# EAGLE design CANdiy-Shield_v20 (EAGLE 7.5.0)
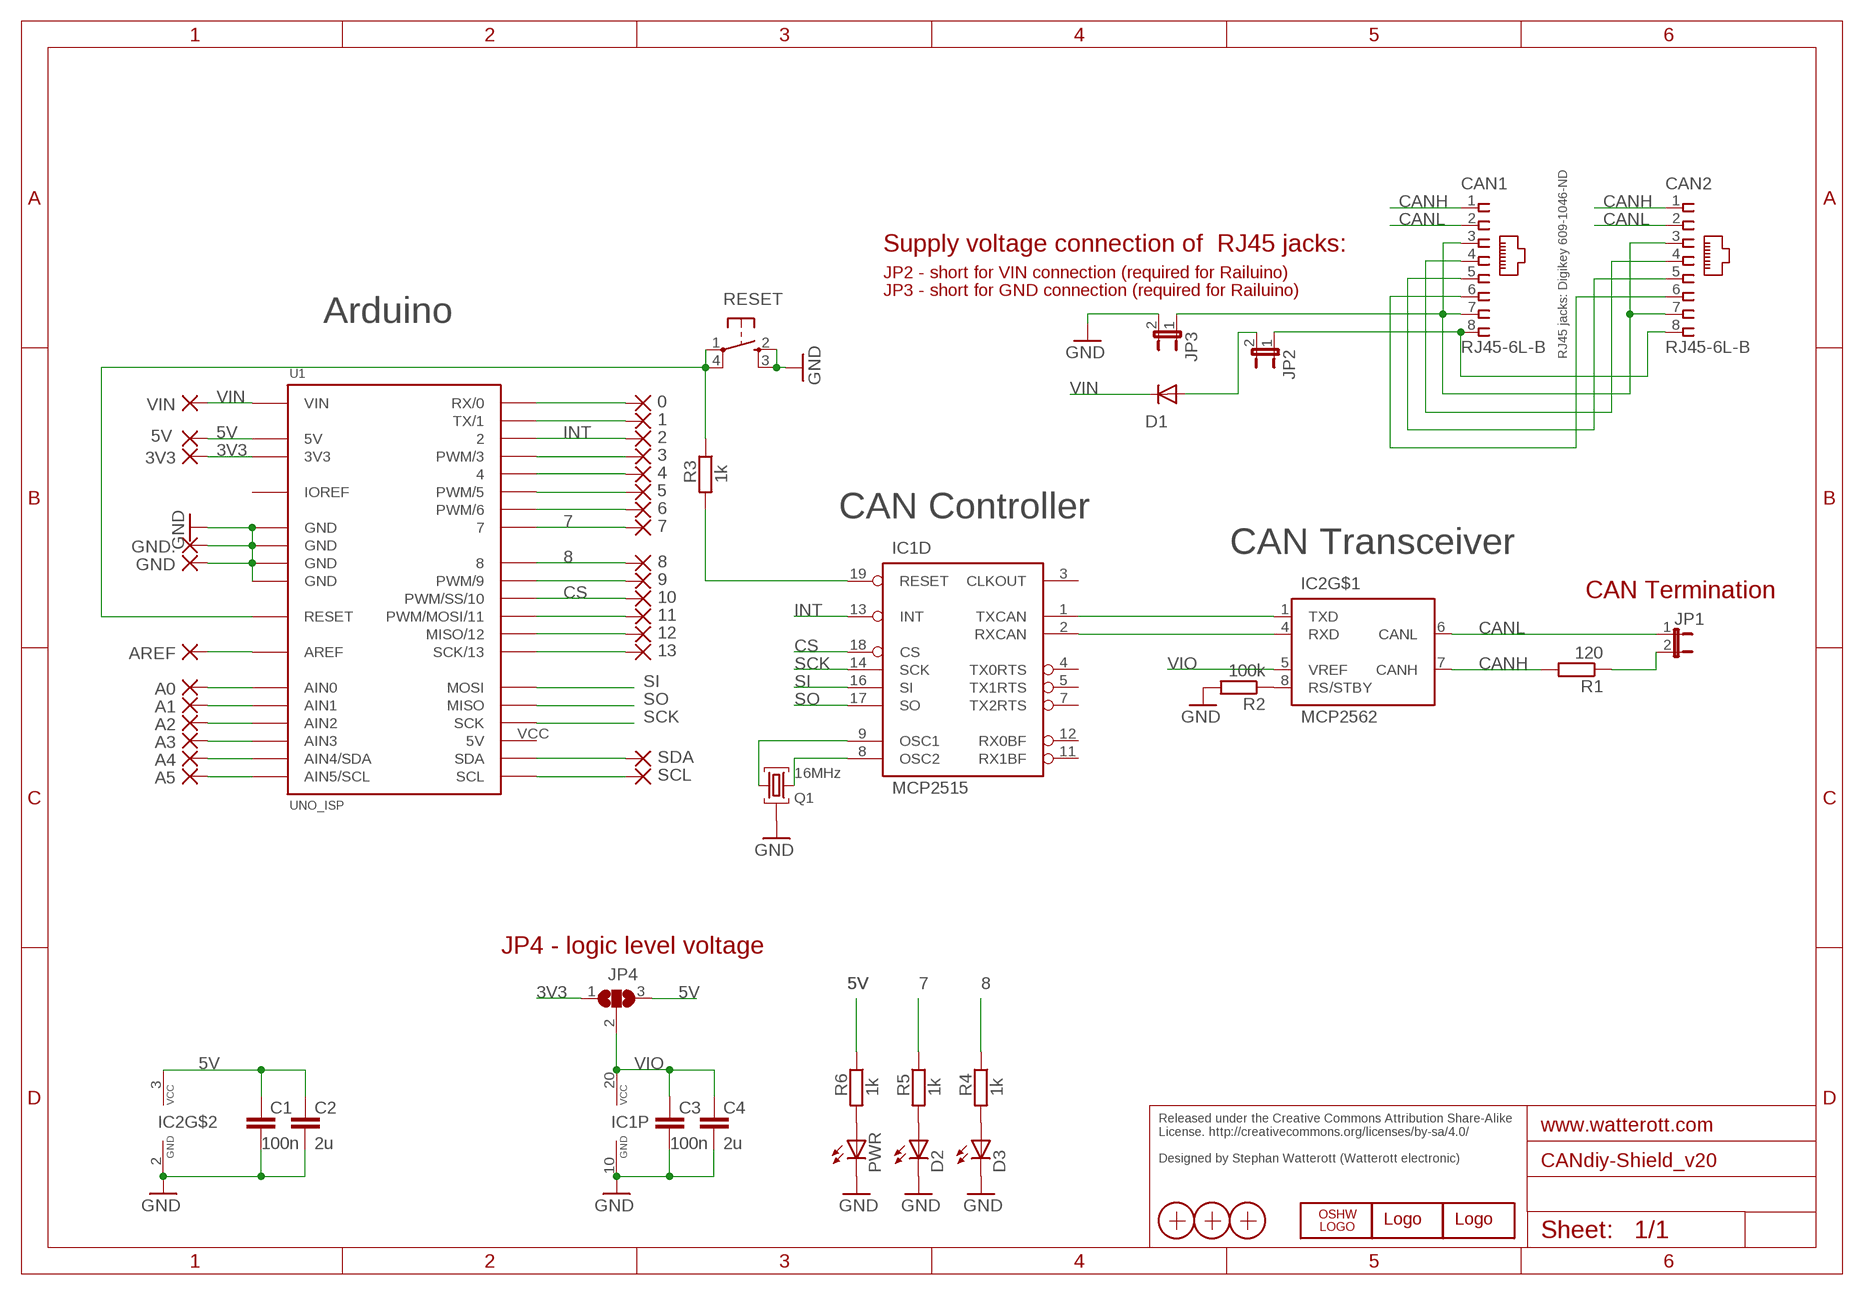
[diagram p0: schematic, sheet 1]

## Parts
0  1,6/0,8  [1,6/0,8]
1  1,6/0,8  [1,6/0,8]
2  1,6/0,8  [1,6/0,8]
3  1,6/0,8  [1,6/0,8]
3V3  1,6/0,8  [1,6/0,8]
4  1,6/0,8  [1,6/0,8]
5  1,6/0,8  [1,6/0,8]
5V  1,6/0,8  [1,6/0,8]
6  1,6/0,8  [1,6/0,8]
7  1,6/0,8  [1,6/0,8]
8  1,6/0,8  [1,6/0,8]
9  1,6/0,8  [1,6/0,8]
10  1,6/0,8  [1,6/0,8]
11  1,6/0,8  [1,6/0,8]
12  1,6/0,8  [1,6/0,8]
13  1,6/0,8  [1,6/0,8]
A0  1,6/0,8  [1,6/0,8]
A1  1,6/0,8  [1,6/0,8]
A2  1,6/0,8  [1,6/0,8]
A3  1,6/0,8  [1,6/0,8]
A4  1,6/0,8  [1,6/0,8]
A5  1,6/0,8  [1,6/0,8]
AREF  1,6/0,8  [1,6/0,8]
C1  100n  C-EUC0603  [C0603]
C2  2u  C-EUC0603  [C0603]
C3  100n  C-EUC0603  [C0603]
C4  2u  C-EUC0603  [C0603]
CAN1  RJ45-6L-B  [RJ45-NO-SHIELD]
CAN2  RJ45-6L-B  [RJ45-NO-SHIELD]
D1  CGRM4001-G  [SOD-123_MINI-SMA]
D2  LEDCHIPLED_0603  [CHIPLED_0603]
D3  LEDCHIPLED_0603  [CHIPLED_0603]
GND  1,6/0,8  [1,6/0,8]
GND.  1,6/0,8  [1,6/0,8]
IC1  MCP2515  MCP2515ST  [TSSOP20]
IC2  MCP2562  MCP2551SO8  [SO08]
JP1  JP1E  [JP1]
JP2  JP1E  [JP1]
JP3  JP1E  [JP1]
JP4  SJ2W  [SJ_2]
LOGO1  LOGO-SPARK_PLACE  [SPARK_TPLACE]
LOGO2  OSHW_LOGO_6MILX0100-NT  [OSHW_6X100_NOTEXT]
PWR  LEDCHIPLED_0603  [CHIPLED_0603]
Q1  16MHz  SMD_OSC2  [SMD_OSC_35X15]
R1  120  R-EU_R0603  [R0603]
R2  100k  R-EU_R0603  [R0603]
R3  1k  R-EU_R0603  [R0603]
R4  1k  R-EU_R0603  [R0603]
R5  1k  R-EU_R0603  [R0603]
R6  1k  R-EU_R0603  [R0603]
RESET  SW_SMDS  [SW_SMD4]
SCL  1,6/0,8  [1,6/0,8]
SDA  1,6/0,8  [1,6/0,8]
U1  UNO_ISP  [UNO_ISP]
U$1  WE-LOGO  [WE-LOGO]
VIN  1,6/0,8  [1,6/0,8]
X1  PASSER  [PASSER]
X2  PASSER  [PASSER]
X3  PASSER  [PASSER]

## Nets
0: 0.1(P) U1.0(RX/0)
1: 1.1(P) U1.1(TX/1)
3: 3.1(P) U1.3(PWM/3)
3V3: 3V3.1(P) JP4.1 U1.3V3
4: 4.1(P) U1.4
5: 5.1(P) U1.5(PWM/5)
5V: 5V.1(P) C1.1 C2.1 IC2.3(VCC) JP4.3 R6.1 U1.5V
6: 6.1(P) U1.6(PWM/6)
7: 7.1(P) R5.1 U1.7
8: 8.1(P) R4.1 U1.8
9: 9.1(P) U1.9(PWM/9)
11: 11.1(P) U1.11(PWM/MOSI/11)
12: 12.1(P) U1.12(MISO/12)
13: 13.1(P) U1.13(SCK/13)
A0: A0.1(P) U1.AIN0
A1: A1.1(P) U1.AIN1
A2: A2.1(P) U1.AIN2
A3: A3.1(P) U1.AIN3
A4: A4.1(P) U1.AIN4(AIN4/SDA)
A5: A5.1(P) U1.AIN5(AIN5/SCL)
AREF: AREF.1(P) U1.AREF
CAN_RX: IC1.2(D:RXCAN) IC2.4(RXD)
CAN_TX: IC1.1(D:TXCAN) IC2.1(TXD)
CANH: CAN1.1 CAN2.1 IC2.7(CANH) R1.2
CANL: CAN1.2 CAN2.2 IC2.6(CANL) JP1.1
CS: 10.1(P) IC1.18(D:CS) U1.10(PWM/SS/10)
GND: C1.2 C2.2 C3.2 C4.2 D2.C D3.C GND.1(P) GND..1(P) IC1.10(P:GND) IC2.2(GND) JP3.2 PWR.C Q1.GND R2.2 RESET.2(S) RESET.3(S1) U1.GND@1(GND) U1.GND@2(GND) U1.GND@3(GND) U1.GND@4(GND)
INT: 2.1(P) IC1.13(D:INT) U1.2
N$1: IC1.19(D:RESET) R3.2
N$6: CAN1.8 CAN2.8 JP2.1
N$7: IC2.8(RS) R2.1
N$8: CAN1.3 CAN1.7 CAN2.3 CAN2.7 JP3.1
N$9: JP1.2 R1.1
N$18: SCL.1(P) U1.SCL
N$19: SDA.1(P) U1.SDA
N$21: D3.A R4.2
N$22: PWR.A R6.2
N$23: D2.A R5.2
N$121: D1.A JP2.2
N$199: CAN1.4 CAN2.4
N$200: CAN1.5 CAN2.5
N$201: CAN1.6 CAN2.6
OSC1: IC1.9(D:OSC1) Q1.1
OSC2: IC1.8(D:OSC2) Q1.2
RESET: R3.1 RESET.1(P) RESET.4(P1) U1.RST(RESET)
SCK: IC1.14(D:SCK) U1.SCK
SI: IC1.16(D:SI) U1.MOSI
SO: IC1.17(D:SO) U1.MISO
VIN: D1.C U1.VIN VIN.1(P)
VIO: C3.1 C4.1 IC1.20(P:VCC) IC2.5(VREF) JP4.2
Unconnected: IC1.3(D:CLKOUT) IC1.4(D:TX0RTS) IC1.5(D:TX1RTS) IC1.7(D:TX2RTS) IC1.11(D:RX1BF) IC1.12(D:RX0BF) U1.VCC(5V)

## Notes on the sheet
- Supply voltage connection of  RJ45 jacks:
- JP2 - short for VIN connection (required for Railuino)
- JP3 - short for GND connection (required for Railuino)
- Arduino
- RJ45 jacks: Digikey 609-1046-ND
- CAN Controller
- CAN Transceiver
- CAN Termination
- /STBY
- JP4 - logic level voltage
- Released under the Creative Commons Attribution Share-Alike 
  License. http://creativecommons.org/licenses/by-sa/4.0/
  
  Designed by Stephan Watterott (Watterott electronic)

## Power pins joined to a net without a drawn wire
IOREF: U1.IOREF

## Library data of the parts
0 1-3 3V3 4 5 5V 6-13 A0 A1-A5 AREF GND GND. SCL SDA VIN = wirepad:1,6/0,8: THROUGH-HOLE PAD
C1-C4 = resistor:C-EU: CAPACITOR, European symbol
CAN1 CAN2 = con-tycoelectronics:RJ45: CORCOM Modular RJ Jacks No Shield Source: www.tycoelectronics.com .. ENG_DS_1654001_1099_RJ_L_0507.pdf; MPN: RJ45-6L-B; OC_FARNELL: unknown; OC_NEWARK: 16R6090
D1 = diode:CGRM400*-G: Molded plasitc,JEDEC SOD-123/Mini SMA Source: Comchip CGRM4001-G.pdf
D2 D3 PWR = led:LED: LED OSRAM: - CHIPLED LG R971, LG N971, LY N971, LG Q971, LY Q971, LO R971, LY R971 LH N974, LH R974 LS Q976, LO Q976, LY Q976 LO Q996 - Hyper CHIPLED LW Q18S LB Q993, LB Q99A, LB R99A - SideLED LS A670, LO A670, LY A670, LG A670, LP A670 LB A673, LV A673, LT A673, LW A673 LH A674 LY A675 LS A676, LA A676, LO A676, LY A676, LW A676 LS A679, LY A679, LG A679 - Hyper Micro SIDELED® LS Y876, LA Y876, LO Y876, LY Y876 LT Y87S - SmartLED LW L88C, LW L88S LB L89C, LB L89S, LG L890 LS L89K, LO L89K, LY L89K LS L896, LA L896, LO L896, LY L896 - TOPLED LS T670, LO T670, LY T670, LG T670, LP T670 LSG T670, LSP T670, LSY T670, LOP T670, LYG T670 LG T671, LOG T671, LSG T671 LB T673, LV T673, LT T673, LW T673 LH T674 LS T676, LA T676, LO T676, LY T676, LB T676, LH T676, LSB T676, LW T676 LB T67C, LV T67C, LT T67C, LS T67K, LO T67K, LY T67K, LW E67C LS E67B, LA E67B, LO E67B, LY E67B, LB E67C, LV E67C, LT E67C LW T67C LS T679, LY T679, LG T679 LS T770, LO T770, LY T770, LG T770, LP T770 LB T773, LV T773, LT T773, LW T773 LH T774 LS E675, LA E675, LY E675, LS T675 LS T776, LA T776, LO T776, LY T776, LB T776 LHGB T686 LT T68C, LB T68C - Hyper Mini TOPLED® LB M676 - Mini TOPLED Santana® LG M470 LS M47K, LO M47K, LY M47K Source: http://www.osram.convergy.de LUXEON: - LUMILED® LXK2-PW12-R00, LXK2-PW12-S00, LXK2-PW14-U00, LXK2-PW14-V00 LXK2-PM12-R00, LXK2-PM12-S00, LXK2-PM14-U00 LXK2-PE12-Q00, LXK2-PE12-R00, LXK2-PE12-S00, LXK2-PE14-T00, LXK2-PE14-U00 LXK2-PB12-K00, LXK2-PB12-L00, LXK2-PB12-M00, LXK2-PB14-N00, LXK2-PB14-P00, LXK2-PB14-Q00 LXK2-PR12-L00, LXK2-PR12-M00, LXK2-PR14-Q00, LXK2-PR14-R00 LXK2-PD12-Q00, LXK2-PD12-R00, LXK2-PD12-S00 LXK2-PH12-R00, LXK2-PH12-S00 LXK2-PL12-P00, LXK2-PL12-Q00, LXK2-PL12-R00 Source: www.luxeon.com KINGBRIGHT: KA-3528ASYC Source: www.kingbright.com
IC1 = can:MCP2515: MC2515 Stand-Alone CAN Controller With SPI Interface, Microchip
IC2 = can:MCP2551: CAN Tranceiver Microchip
JP1-JP3 = jumper:JP1E: JUMPER
JP4 = jumper:SJ2W: SMD solder JUMPER
LOGO1 = we-symbol:LOGO
LOGO2 = OSHW:OSHW_LOGO_6MIL
Q1 = crystal:SMD_OSC
R1 R2 = resistor:R-EU_: RESISTOR, European symbol
R3-R6 = rcl:R-EU_: RESISTOR, European symbol
RESET = Switch-SMD:SW_SMD
U1 = Arduino:UNO_ISP
U$1 = welectronic:WE-LOGO
X1-X3 = we-symbol:PASSER

## Board
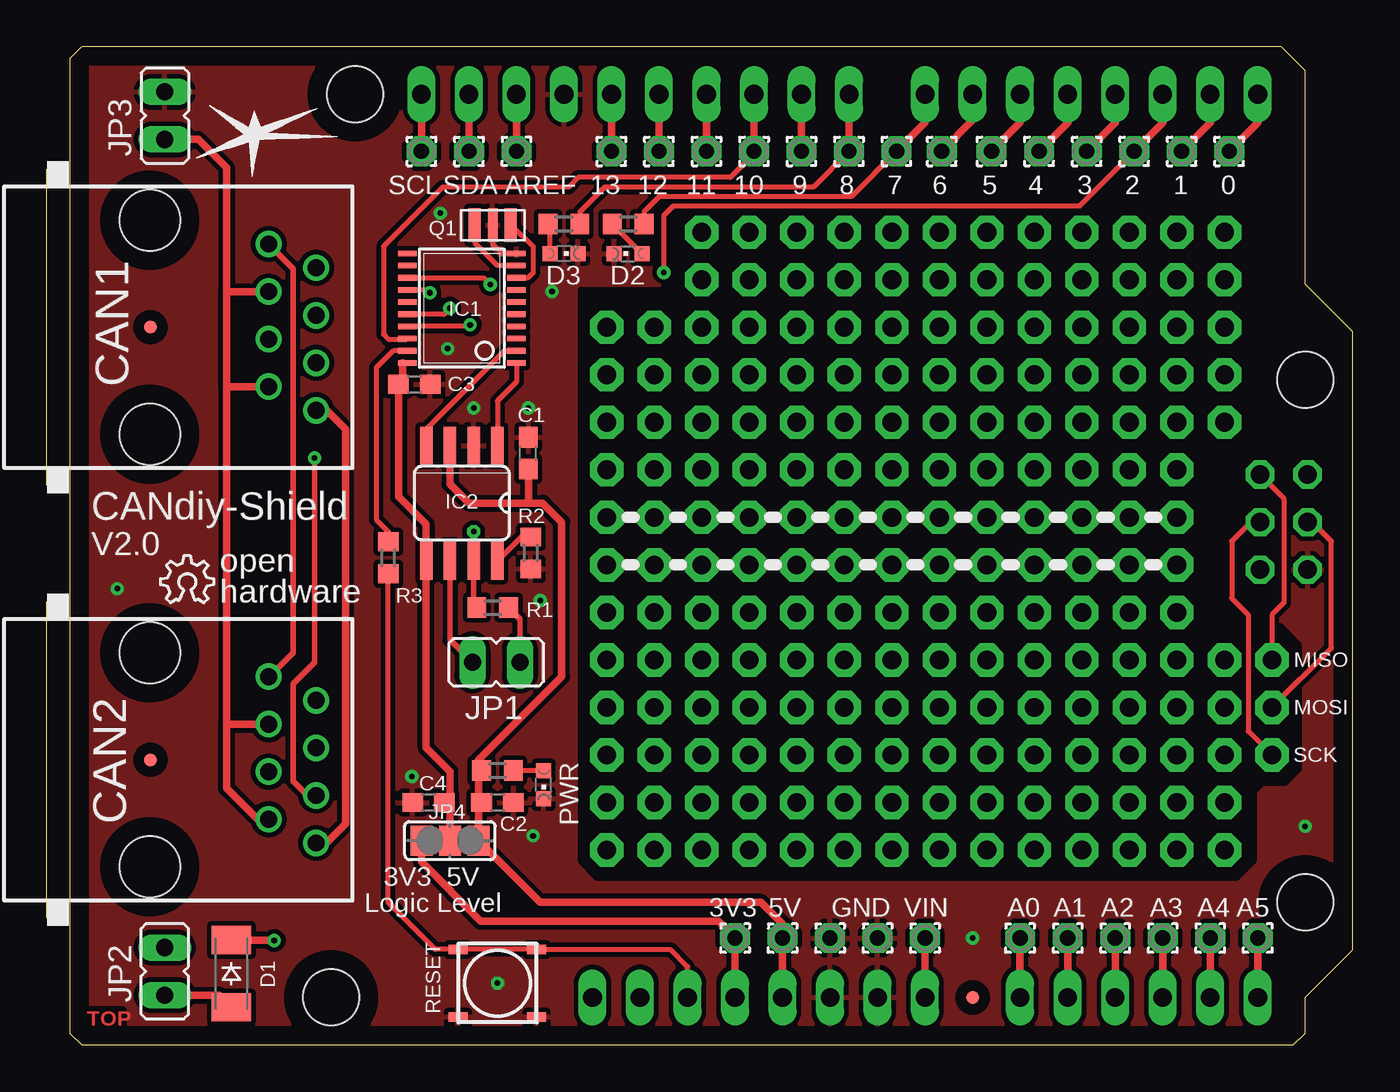
[diagram p1: board, top side]
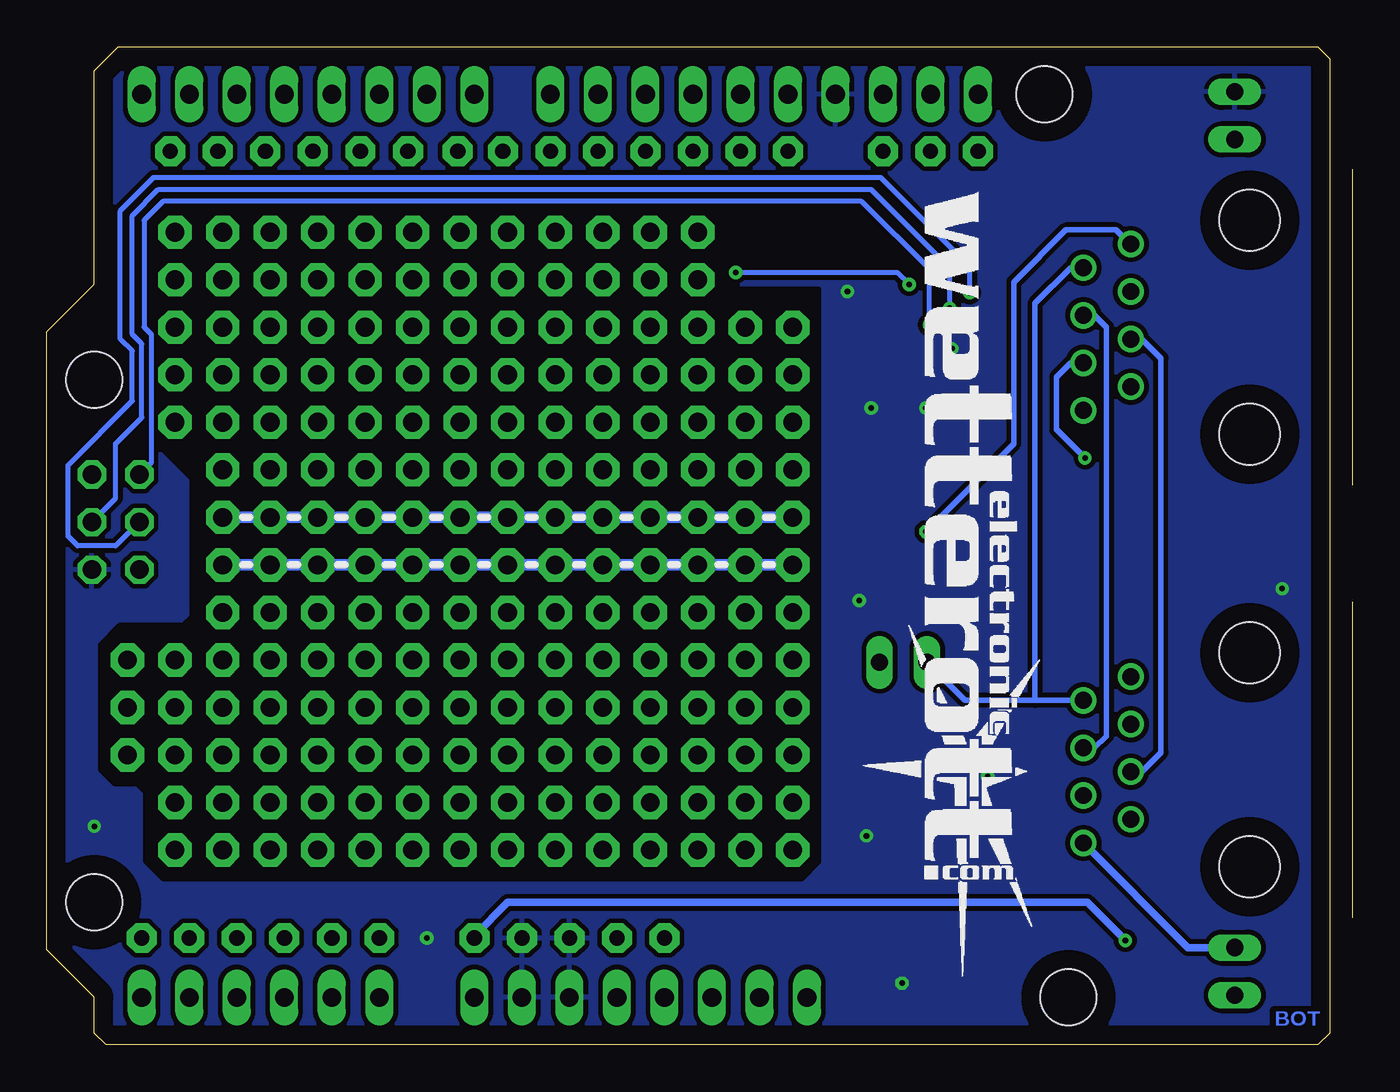
[diagram p2: board, bottom side, seen from below]

Size 69.81 x 53.34 mm. Coordinates in mm from the lower left corner, seen from the top.
Copper layers (1*16): Top 0.035mm / dielectric 1.5mm / Bottom 0.035mm
Design rules "default *": minimum track width 6mil, minimum drill 0.29mm, track to track 6mil, track to pad 6mil, pad to pad 6mil, via to via 6mil, smd to smd 6mil, copper to edge 40mil, drill to drill 6mil, minimum pad ring 10mil, minimum via ring 8mil, stop-mask expansion 4mil, vias tented up to drill 0.6mm, thermal gap 10mil

### Footprints (pad centres in the part's own frame; a part is rotated, then mirrored left to right if it is on the bottom)
1,6/0,8 = drill 0.813 pad 1.6 octagon: 1 0,0
C0603 = smd 1.1 x 1: 1 -0.85,0; 2 0.85,0
RJ45-NO-SHIELD = drill 0.9 pad 1.4: 1 -4.445,6.35; 2 -3.175,8.89; 3 -1.905,6.35; 4 -0.635,8.89; 5 0.635,6.35; 6 1.905,8.89; 7 3.175,6.35; 8 4.445,8.89 | hole 3.251: -5.715,0; 5.715,0
SOD-123_MINI-SMA = smd 1.5 x 2.1: A 1.8,0; C -1.8,0
CHIPLED_0603 = smd 0.8 x 0.8: A 0,-0.75; C 0,0.75
TSSOP20 = smd 0.305 x 0.991: 1 -2.925,-2.918; 2 -2.275,-2.918; 3 -1.625,-2.918; 4 -0.975,-2.918; 5 -0.325,-2.918; 6 0.325,-2.918; 7 0.975,-2.918; 8 1.625,-2.918; 9 2.275,-2.918; 10 2.925,-2.918; 11 2.925,2.918; 12 2.275,2.918; 13 1.625,2.918; 14 0.975,2.918; 15 0.325,2.918; 16 -0.325,2.918; 17 -0.975,2.918; 18 -1.625,2.918; 19 -2.275,2.918; 20 -2.925,2.918
SO08 = smd 0.66 x 2.032: 1 -1.905,-3.073; 2 -0.635,-3.073; 3 0.635,-3.073; 4 1.905,-3.073; 5 1.905,3.073; 6 0.635,3.073; 7 -0.635,3.073; 8 -1.905,3.073
JP1 = drill 0.914 long: 1 0,-1.27; 2 0,1.27
SJ_2 = smd 1.168 x 1.6: 1 -1.524,0; 2 0,0; 3 1.524,0
SMD_OSC_35X15 = smd 0.635 x 1.778: 1 -0.965,0; 2 0.965,0 | smd 0.508 x 1.778: GND 0,0
R0603 = smd 1 x 1.1: 1 -0.85,0; 2 0.85,0
SW_SMD4 = smd 0.508 x 1.016: 1 -1.8,-2.1; 2 1.8,-2.1; 3 1.8,2.1; 4 -1.8,2.1
UNO_ISP = drill 1 long: 0 63.5,50.8; 1 60.96,50.8; 2 58.42,50.8; 3 55.88,50.8; 3V3 35.56,2.54; 4 53.34,50.8; 5 50.8,50.8; 5V 38.1,2.54; 6 48.26,50.8; 7 45.72,50.8; 8 41.656,50.8; 9 39.116,50.8; 10 36.576,50.8; 11 34.036,50.8; 12 31.496,50.8; 13 28.956,50.8; AIN0 50.8,2.54; AIN1 53.34,2.54; AIN2 55.88,2.54; AIN3 58.42,2.54; AIN4 60.96,2.54; AIN5 63.5,2.54; AREF 23.876,50.8; GND@1 40.64,2.54; GND@2 43.18,2.54; GND@3 26.416,50.8; IOREF 30.48,2.54; NC 27.94,2.54; RST 33.02,2.54; SCL 18.796,50.8; SDA 21.336,50.8; VIN 45.72,2.54 | drill 1 octagon: GND@4 66.167,25.4; MISO 63.627,30.48; MOSI 66.167,27.94; RST2 63.627,25.4; SCK 63.627,27.94; VCC 66.167,30.48 | hole 3: 66.04,35.56; 66.04,7.62; 15.24,50.8; 13.97,2.54
PASSER = smd 0.7 x 0.7: X 0,0

### Placement (x,y rotation side)
0  63.21,47.75 180 top
1  60.67,47.75 180 top
2  58.13,47.75 180 top
3  55.59,47.75 180 top
3V3  36.79,5.71 0 top
4  53.05,47.75 180 top
5  50.51,47.75 180 top
5V  39.33,5.71 0 top
6  47.84,47.75 180 top
7  45.43,47.75 180 top
8  42.89,47.75 180 top
9  40.35,47.75 180 top
10  37.81,47.75 180 top
11  35.27,47.75 180 top
12  32.73,47.75 180 top
13  30.19,47.75 180 top
A0  52.03,5.71 0 top
A1  54.57,5.71 0 top
A2  57.11,5.71 0 top
A3  59.65,5.71 0 top
A4  62.19,5.71 0 top
A5  64.73,5.71 0 top
AREF  25.11,47.75 0 top
C1  25.74,31.62 90 top
C2  24.09,12.95 0 top
C3  19.65,35.31 0 top
C4  20.41,12.95 180 top
CAN1  5.51,38.35 270 top
CAN2  5.51,15.24 270 top
D1  9.87,3.81 270 top
D2  31.08,42.29 90 top
D3  27.65,42.29 270 top
GND  41.87,5.71 0 top
GND.  44.41,5.71 0 top
IC1  22.19,39.37 90 top
IC2  22.19,28.96 180 top
JP1  24.03,20.45 270 top
JP2  6.31,3.94 180 top
JP3  6.31,49.66 0 top
JP4  21.55,10.92 0 top
LOGO1  11.14,48.64 0 top
LOGO2  6.09,23.62 0 top
PWR  26.57,13.91 180 top
Q1  23.84,43.82 0 top
R1  23.84,23.37 180 top
R2  25.87,26.29 270 top
R3  18.25,26.04 90 top
R4  27.65,43.88 180 top
R5  31.08,43.88 180 top
R6  24.09,14.67 0 top
RESET  24.09,3.3 270 top
SCL  20.03,47.75 180 top
SDA  22.57,47.75 180 top
U1  1.23,0 0 top
U$1  26.5,45.85 270 bottom
VIN  46.95,5.71 0 top
X1  5.55,15.24 0 top
X2  5.55,38.35 0 top
X3  49.49,2.54 0 top

### Tracks (layer width: path | path; a pad name or v marks a point on that pad's centre or on a via)
0
  Top 0.406: U1.0 64.73,49.28 0.1
1
  Top 0.406: U1.1 62.19,49.28 1.1
3
  Top 0.406: U1.3 57.11,49.28 3.1
3V3
  Top 0.406: U1.3V3 3V3.1 35.9,6.6 23.2,6.6 20.03,9.78 JP4.1
4
  Top 0.406: U1.4 54.57,49.28 4.1
5
  Top 0.406: U1.5 52.03,49.28 5.1
5V
  Top 0.254: 23.08,12.79 C2.1 23.08,12.95 | 23.08,14.5 R6.1 23.14,14.67 23.08,14.73
  Top 0.406: U1.5V 5V.1 39.33,6.48 38.19,7.62 26.38,7.62 JP4.3 23.08,12.79 | IC2.3 21.55,29.97 22.57,28.96 25.74,28.96 | 25.74,28.96 26.5,28.96 27.52,27.94 27.52,19.68 23.08,15.24 23.08,14.73 | C1.1 25.74,28.96 | 23.08,12.95 23.08,14.5
6
  Top 0.406: U1.6 49.49,49.4 6.1
7
  Top 0.254: 7.1 43.01,45.34 32.73,45.34 31.93,44.54 R5.1
  Top 0.406: U1.7 46.95,49.28 7.1
8
  Top 0.254: 8.1 40.98,45.85 29.81,45.85 28.5,44.54 R4.1
  Top 0.406: U1.8 8.1
9
  Top 0.406: U1.9 9.1
11
  Top 0.406: 11.1 U1.11
12
  Top 0.406: 12.1 U1.12
13
  Top 0.406: 13.1 U1.13
A0
  Top 0.406: U1.AIN0 A0.1
A1
  Top 0.406: U1.AIN1 A1.1
A2
  Top 0.406: U1.AIN2 A2.1
A3
  Top 0.406: U1.AIN3 A3.1
A4
  Top 0.406: U1.AIN4 A4.1
A5
  Top 0.406: U1.AIN5 A5.1
AREF
  Top 0.406: AREF.1 U1.AREF
CAN_RX
  Top 0.254: IC2.4 20.28,32.89 24.47,37.08 25.09,37.08 IC1.2
CAN_TX
  Top 0.254: IC1.1 25.1,35.43 24.09,34.42 IC2.1
CANH  (via drill 0.3)
  Top 0.254: CAN2.1 11.9,19.68
  Top 0.305: R1.2 22.82,23.53 IC2.7 v22.82,27.43 | 11.9,19.68 13.17,20.95 13.17,41.49 CAN1.1
  Bottom 0.254: CAN1.1 11.9,42.8
  Bottom 0.305: 11.9,42.8 12.66,43.56 15.33,43.56 18.12,40.77 18.12,32.13 v22.82,27.43
CANL
  Top 0.305: IC2.6 21.55,21.65 JP1.1
  Bottom 0.305: CAN2.2 16.98,18.41 | 16.98,18.41 20.73,18.41 JP1.1 | CAN1.2 15.07,41.53 16.98,39.62 16.98,18.41
CS
  Top 0.254: 10.1 37.81,47.62 36.54,46.36 28.41,46.36 27.9,45.85 21.17,45.85 18,42.67 18,37.97 18.25,37.72 19.24,37.72 IC1.18
  Top 0.406: U1.10 10.1
GND  (via drill 0.3)
  Top 0.254: IC1.10 24.34,42.3 23.84,42.8 Q1.GND
  other vias: 22.82,34.04 21.42,37.21 27.01,40.26 24.09,3.3 21.04,44.45 26.38,23.75 25.74,34.04 67.27,11.68 19.52,14.35 26,11.18 3.77,24.38 49.49,5.71
  pour Bottom (isolate 0.254): 1.23,53.47 69.81,53.47 69.81,0.13 1.23,0.13
  pour Top (isolate 0.254): 1.23,0.13 1.23,53.47 69.81,53.47 69.81,0.13
INT  (via drill 0.3)
  Top 0.254: 2.1 55.21,44.83 33.49,44.83 32.98,44.32 v32.98,41.28 | IC1.13 23.36,41 v23.71,40.64
  Top 0.406: U1.2 59.65,49.28 2.1
  Bottom 0.254: v23.71,40.64 24.35,41.28 v32.98,41.28
N$1
  Top 0.254: IC1.19 18.51,37.1 17.61,36.2 17.61,28.07 18.25,27.43 R3.2
N$2  (via drill 1 pad 1.78)
  other vias: 32.47,15.49
N$3  (via drill 1 pad 1.78)
  other vias: 29.93,15.49
N$4  (via drill 1 pad 1.78)
  other vias: 32.47,12.95
N$5  (via drill 1 pad 1.78)
  other vias: 29.93,12.95
N$6
  Top 0.406: CAN2.8 14.95,10.79 15.96,11.81 15.96,32.89 14.95,33.91 CAN1.8
  Bottom 0.406: JP2.1 8.81,5.21 CAN2.8
N$7
  Top 0.254: R2.1 25.35,27.14 IC2.8
N$8
  Top 0.406: JP3.1 8.09,48.39 9.61,46.86 9.61,40.26 | 9.61,40.26 CAN1.3 | 9.61,35.18 9.61,40.26 | CAN1.7 9.61,35.18 | 9.61,35.18 9.61,17.14 | 9.61,17.14 CAN2.3 | CAN2.7 11.26,12.07 9.61,13.72 9.61,17.14
N$9
  Top 0.305: JP1.2 25.3,22.76 R1.1
N$10  (via drill 1 pad 1.78)
  other vias: 60.41,35.81
N$11  (via drill 1 pad 1.78)
  other vias: 57.87,35.81
N$12  (via drill 1 pad 1.78)
  other vias: 55.33,35.81
N$14  (via drill 1 pad 1.78)
  other vias: 52.79,35.81
N$15  (via drill 1 pad 1.78)
  other vias: 50.25,35.81
N$16  (via drill 1 pad 1.78)
  other vias: 47.71,35.81
N$17  (via drill 1 pad 1.78)
  other vias: 45.17,35.81
N$18
  Top 0.406: SCL.1 U1.SCL
N$19
  Top 0.406: SDA.1 U1.SDA
N$20  (via drill 1 pad 1.78)
  other vias: 42.63,38.35
N$21
  Top 0.254: D3.A 26.9,43.78 R4.2
N$22
  Top 0.254: R6.2 26.56,14.67 PWR.A
N$23
  Top 0.254: D2.A R5.2
N$24  (via drill 1 pad 1.78)
  other vias: 42.63,10.41
N$25  (via drill 1 pad 1.78)
  other vias: 42.63,35.81
N$26  (via drill 1 pad 1.78)
  other vias: 62.95,38.35
N$27  (via drill 1 pad 1.78)
  other vias: 60.41,38.35
N$28  (via drill 1 pad 1.78)
  other vias: 57.87,38.35
N$29  (via drill 1 pad 1.78)
  other vias: 55.33,38.35
N$30  (via drill 1 pad 1.78)
  other vias: 52.79,38.35
N$31  (via drill 1 pad 1.78)
  other vias: 50.25,38.35
N$32  (via drill 1 pad 1.78)
  other vias: 47.71,38.35
N$33  (via drill 1 pad 1.78)
  other vias: 45.17,38.35
N$34  (via drill 1 pad 1.78)
  other vias: 42.63,33.27
N$35  (via drill 1 pad 1.78)
  other vias: 42.63,30.73
N$36  (via drill 1 pad 1.78)
  other vias: 42.63,28.19
N$37  (via drill 1 pad 1.78)
  other vias: 62.95,40.89
N$38  (via drill 1 pad 1.78)
  other vias: 60.41,40.89
N$39  (via drill 1 pad 1.78)
  other vias: 57.87,40.89
N$40  (via drill 1 pad 1.78)
  other vias: 55.33,40.89
N$41  (via drill 1 pad 1.78)
  other vias: 62.95,20.57
N$42  (via drill 1 pad 1.78)
  other vias: 62.95,10.41
N$43  (via drill 1 pad 1.78)
  other vias: 60.41,10.41
N$44  (via drill 1 pad 1.78)
  other vias: 57.87,10.41
N$45  (via drill 1 pad 1.78)
  other vias: 55.33,10.41
N$46  (via drill 1 pad 1.78)
  other vias: 52.79,10.41
N$47  (via drill 1 pad 1.78)
  other vias: 50.25,10.41
N$48  (via drill 1 pad 1.78)
  other vias: 47.71,10.41
N$49  (via drill 1 pad 1.78)
  other vias: 45.17,10.41
N$50  (via drill 1 pad 1.78)
  other vias: 52.79,40.89
N$51  (via drill 1 pad 1.78)
  other vias: 50.25,40.89
N$52  (via drill 1 pad 1.78)
  other vias: 47.71,40.89
N$53  (via drill 1 pad 1.78)
  other vias: 45.17,40.89
N$54  (via drill 1 pad 1.78)
  other vias: 42.63,25.65
N$55  (via drill 1 pad 1.78)
  other vias: 62.95,43.43
N$56  (via drill 1 pad 1.78)
  other vias: 60.41,43.43
N$57  (via drill 1 pad 1.78)
  other vias: 57.87,43.43
N$58  (via drill 1 pad 1.78)
  other vias: 55.33,43.43
N$59  (via drill 1 pad 1.78)
  other vias: 60.41,33.27
N$60  (via drill 1 pad 1.78)
  other vias: 57.87,33.27
N$61  (via drill 1 pad 1.78)
  other vias: 55.33,33.27
N$62  (via drill 1 pad 1.78)
  other vias: 52.79,33.27
N$63  (via drill 1 pad 1.78)
  other vias: 50.25,33.27
N$64  (via drill 1 pad 1.78)
  other vias: 47.71,33.27
N$65  (via drill 1 pad 1.78)
  other vias: 45.17,33.27
N$66  (via drill 1 pad 1.78)
  other vias: 52.79,43.43
N$67  (via drill 1 pad 1.78)
  other vias: 50.25,43.43
N$68  (via drill 1 pad 1.78)
  other vias: 47.71,43.43
N$69  (via drill 1 pad 1.78)
  other vias: 45.17,43.43
N$70  (via drill 1 pad 1.78)
  other vias: 42.63,23.11
N$71  (via drill 1 pad 1.78)
  other vias: 40.09,10.41
N$72  (via drill 1 pad 1.78)
  other vias: 62.95,18.03
N$73  (via drill 1 pad 1.78)
  other vias: 62.95,15.49
N$74  (via drill 1 pad 1.78)
  other vias: 62.95,12.95
N$75  (via drill 1 pad 1.78)
  other vias: 60.41,30.73
N$76  (via drill 1 pad 1.78)
  other vias: 57.87,30.73
N$77  (via drill 1 pad 1.78)
  other vias: 55.33,30.73
N$78  (via drill 1 pad 1.78)
  other vias: 52.79,30.73
N$79  (via drill 1 pad 1.78)
  other vias: 50.25,30.73
N$80  (via drill 1 pad 1.78)
  other vias: 47.71,30.73
N$81  (via drill 1 pad 1.78)
  other vias: 45.17,30.73
N$82  (via drill 1 pad 1.78)
  other vias: 42.63,20.57
N$83  (via drill 1 pad 1.78)
  other vias: 42.63,18.03
N$84  (via drill 1 pad 1.78)
  other vias: 42.63,15.49
N$85  (via drill 1 pad 1.78)
  other vias: 42.63,12.95
N$86  (via drill 1 pad 1.78)
  other vias: 32.47,10.41
N$87  (via drill 1 pad 1.78)
  other vias: 29.93,10.41
N$89  (via drill 1 pad 1.78)
  other vias: 37.55,10.41
N$90  (via drill 1 pad 1.78)
  other vias: 42.63,40.89
N$91
  cutout Top: 33.62,43.88 34.44,44.83 63.84,44.83 64.41,44.26 64.41,32.64 62.06,30.29 62.06,22.86 62.51,22.42 65.94,22.42 66.95,21.4 66.95,14.73 66.19,13.97 64.99,13.97 64.54,13.53 64.54,9.84 63.59,8.89 29.43,8.89 28.54,9.78 28.54,40.39 33.36,40.39 33.62,40.64 33.62,44.07
N$92  (via drill 1 pad 1.78)
  other vias: 57.87,28.19
N$93  (via drill 1 pad 1.78)
  other vias: 55.33,28.19
N$94  (via drill 1 pad 1.78)
  other vias: 52.79,28.19
N$95  (via drill 1 pad 1.78)
  other vias: 50.25,28.19
N$96  (via drill 1 pad 1.78)
  other vias: 47.71,28.19
N$97  (via drill 1 pad 1.78)
  other vias: 45.17,28.19
N$104  (via drill 1 pad 1.78)
  other vias: 42.63,43.43
N$108  (via drill 1 pad 1.78)
  other vias: 57.87,25.65
N$110  (via drill 1 pad 1.78)
  other vias: 52.79,25.65
N$111  (via drill 1 pad 1.78)
  other vias: 50.25,25.65
N$112  (via drill 1 pad 1.78)
  other vias: 47.71,25.65
N$113  (via drill 1 pad 1.78)
  other vias: 45.17,25.65
N$119  (via drill 1 pad 1.78)
  other vias: 62.95,35.81
N$121
  Top 0.406: JP2.2 9.21,2.67 D1.A
N$122
  cutout Bottom: 33.62,44.01 34.44,44.83 63.84,44.83 64.41,44.26 64.41,32.64 62.06,30.29 62.06,22.86 62.51,22.42 65.94,22.42 66.95,21.4 66.95,14.73 66.19,13.97 64.99,13.97 64.54,13.53 64.54,9.84 63.59,8.89 29.43,8.89 28.54,9.78 28.54,40.39 33.36,40.39 33.62,40.64
N$123  (via drill 1 pad 1.78)
  other vias: 60.41,23.11
N$124  (via drill 1 pad 1.78)
  other vias: 57.87,23.11
N$125  (via drill 1 pad 1.78)
  other vias: 55.33,23.11
N$126  (via drill 1 pad 1.78)
  other vias: 52.79,23.11
N$127  (via drill 1 pad 1.78)
  other vias: 50.25,23.11
N$128  (via drill 1 pad 1.78)
  other vias: 47.71,23.11
N$129  (via drill 1 pad 1.78)
  other vias: 45.17,23.11
N$130  (via drill 1 pad 1.78)
  other vias: 40.09,38.35
N$131  (via drill 1 pad 1.78)
  other vias: 37.55,38.35
N$132  (via drill 1 pad 1.78)
  other vias: 40.09,35.81
N$133  (via drill 1 pad 1.78)
  other vias: 37.55,35.81
N$134  (via drill 1 pad 1.78)
  other vias: 40.09,33.27
N$135  (via drill 1 pad 1.78)
  other vias: 37.55,33.27
N$136  (via drill 1 pad 1.78)
  other vias: 40.09,30.73
N$137  (via drill 1 pad 1.78)
  other vias: 37.55,30.73
N$138  (via drill 1 pad 1.78)
  other vias: 40.09,28.19
N$139  (via drill 1 pad 1.78)
  other vias: 60.41,20.57
N$140  (via drill 1 pad 1.78)
  other vias: 57.87,20.57
N$141  (via drill 1 pad 1.78)
  other vias: 55.33,20.57
N$142  (via drill 1 pad 1.78)
  other vias: 52.79,20.57
N$143  (via drill 1 pad 1.78)
  other vias: 50.25,20.57
N$144  (via drill 1 pad 1.78)
  other vias: 47.71,20.57
N$145  (via drill 1 pad 1.78)
  other vias: 45.17,20.57
N$146  (via drill 1 pad 1.78)
  other vias: 37.55,28.19
N$147  (via drill 1 pad 1.78)
  other vias: 40.09,40.89
N$148  (via drill 1 pad 1.78)
  other vias: 37.55,40.89
N$149  (via drill 1 pad 1.78)
  other vias: 40.09,43.43
N$150  (via drill 1 pad 1.78)
  other vias: 37.55,43.43
N$151  (via drill 1 pad 1.78)
  other vias: 35.01,38.35
N$152  (via drill 1 pad 1.78)
  other vias: 35.01,35.81
N$153  (via drill 1 pad 1.78)
  other vias: 35.01,33.27
N$154  (via drill 1 pad 1.78)
  other vias: 35.01,30.73
N$155  (via drill 1 pad 1.78)
  other vias: 60.41,18.03
N$156  (via drill 1 pad 1.78)
  other vias: 57.87,18.03
N$157  (via drill 1 pad 1.78)
  other vias: 55.33,18.03
N$158  (via drill 1 pad 1.78)
  other vias: 52.79,18.03
N$159  (via drill 1 pad 1.78)
  other vias: 50.25,18.03
N$160  (via drill 1 pad 1.78)
  other vias: 47.71,18.03
N$161  (via drill 1 pad 1.78)
  other vias: 45.17,18.03
N$162  (via drill 1 pad 1.78)
  Top 0.61: v35.01,28.19 v60.41,28.19
  Bottom 0.61: v35.01,28.19 v60.41,28.19
N$163  (via drill 1 pad 1.78)
  other vias: 35.01,40.89
N$164  (via drill 1 pad 1.78)
  other vias: 35.01,43.43
N$165  (via drill 1 pad 1.78)
  other vias: 40.09,25.65
N$166  (via drill 1 pad 1.78)
  other vias: 37.55,25.65
N$167  (via drill 1 pad 1.78)
  other vias: 40.09,23.11
N$168  (via drill 1 pad 1.78)
  other vias: 37.55,23.11
N$169  (via drill 1 pad 1.78)
  other vias: 40.09,20.57
N$171  (via drill 1 pad 1.78)
  other vias: 60.41,15.49
N$172  (via drill 1 pad 1.78)
  other vias: 57.87,15.49
N$173  (via drill 1 pad 1.78)
  other vias: 55.33,15.49
N$174  (via drill 1 pad 1.78)
  other vias: 52.79,15.49
N$175  (via drill 1 pad 1.78)
  other vias: 50.25,15.49
N$176  (via drill 1 pad 1.78)
  other vias: 47.71,15.49
N$177  (via drill 1 pad 1.78)
  other vias: 45.17,15.49
N$178  (via drill 1 pad 1.78)
  other vias: 37.55,20.57
N$179  (via drill 1 pad 1.78)
  other vias: 40.09,18.03
N$180  (via drill 1 pad 1.78)
  other vias: 37.55,18.03
N$181  (via drill 1 pad 1.78)
  other vias: 40.09,15.49
N$182  (via drill 1 pad 1.78)
  other vias: 37.55,15.49
N$183  (via drill 1 pad 1.78)
  other vias: 40.09,12.95
N$184  (via drill 1 pad 1.78)
  other vias: 37.55,12.95
N$185  (via drill 1 pad 1.78)
  other vias: 35.01,10.41
N$186  (via drill 1 pad 1.78)
  other vias: 35.01,25.65
N$187  (via drill 1 pad 1.78)
  other vias: 60.41,12.95
N$188  (via drill 1 pad 1.78)
  other vias: 57.87,12.95
N$189  (via drill 1 pad 1.78)
  other vias: 55.33,12.95
N$190  (via drill 1 pad 1.78)
  other vias: 52.79,12.95
N$191  (via drill 1 pad 1.78)
  other vias: 50.25,12.95
N$192  (via drill 1 pad 1.78)
  other vias: 47.71,12.95
N$193  (via drill 1 pad 1.78)
  other vias: 45.17,12.95
N$194  (via drill 1 pad 1.78)
  other vias: 35.01,23.11
N$195  (via drill 1 pad 1.78)
  other vias: 35.01,20.57
N$196  (via drill 1 pad 1.78)
  other vias: 35.01,18.03
N$197  (via drill 1 pad 1.78)
  other vias: 35.01,15.49
N$198  (via drill 1 pad 1.78)
  other vias: 35.01,12.95
N$199
  Bottom 0.305: CAN1.4 13.8,38.99 13.17,38.35 13.17,16.51 13.8,15.88 CAN2.4
N$200
  Bottom 0.305: CAN2.5 11.26,14.61 10.25,15.62 10.25,36.7 11.26,37.72 CAN1.5
N$201  (via drill 0.3)
  Top 0.305: CAN2.6 13.93,13.34 13.17,14.1 13.17,19.3 14.31,20.45 v14.31,31.37
  Bottom 0.305: CAN1.6 15.07,36.45 15.84,35.69 15.84,32.89 v14.31,31.37
N$202  (via drill 1 pad 1.78)
  Top 0.61: 30.06,25.65 v55.33,25.65 v60.41,25.65
  Bottom 0.61: v55.33,25.65 29.93,25.65 | v60.41,25.65 v55.33,25.65 | v55.33,25.65 35.14,25.65
N$203  (via drill 1 pad 1.78)
  other vias: 32.47,38.35
N$204  (via drill 1 pad 1.78)
  other vias: 32.47,35.81
N$205  (via drill 1 pad 1.78)
  other vias: 32.47,33.27
N$206  (via drill 1 pad 1.78)
  other vias: 32.47,30.73
N$207  (via drill 1 pad 1.78)
  other vias: 32.47,28.19
N$208  (via drill 1 pad 1.78)
  other vias: 29.93,38.35
N$209  (via drill 1 pad 1.78)
  other vias: 29.93,35.81
N$210  (via drill 1 pad 1.78)
  other vias: 29.93,33.27
N$211  (via drill 1 pad 1.78)
  other vias: 29.93,30.73
N$212  (via drill 1 pad 1.78)
  Top 0.61: v29.93,28.19 55.33,28.19
  Bottom 0.61: v29.93,28.19 35.01,28.19
N$213  (via drill 1 pad 1.78)
  other vias: 32.47,25.65
N$214  (via drill 1 pad 1.78)
  other vias: 32.47,23.11
N$215  (via drill 1 pad 1.78)
  other vias: 32.47,20.57
N$216  (via drill 1 pad 1.78)
  other vias: 32.47,18.03
N$217  (via drill 1 pad 1.78)
  other vias: 29.93,25.65
N$218  (via drill 1 pad 1.78)
  other vias: 29.93,23.11
N$219  (via drill 1 pad 1.78)
  other vias: 29.93,20.57
N$220  (via drill 1 pad 1.78)
  other vias: 29.93,18.03
N$2512  (via drill 1 pad 1.78)
  other vias: 62.95,33.27
OSC1
  Top 0.254: Q1.1 22.87,42.88 24.1,41.65 IC1.9
OSC2
  Top 0.254: Q1.2 24.85,43.82 26,42.67 26,41.28 25.72,41 IC1.8
RESET
  Top 0.254: U1.RST 34.25,4.19 33.36,5.08 26.21,5.08 RESET.4 | RESET.4 RESET.1 | RESET.4 20.77,5.1 18.25,7.62 R3.1
SCK  (via drill 0.3, 1 pad 1.78)
  Top 0.254: U1.SCK 64.35,27.94 63.33,26.92 63.33,23.88 64.22,22.99 64.22,16.76 v65.49,15.49 | IC1.14 20.32,40.35 v20.47,40.2
  Bottom 0.254: U1.SCK 66.13,26.67 68.16,26.67 68.67,27.18 68.67,30.99 65.24,34.42 65.24,37.08 65.87,37.72 65.87,44.58 64.1,46.36 25.23,46.36 20.47,41.59 v20.47,40.2
SI  (via drill 0.3, 1 pad 1.78)
  Top 0.254: v65.49,18.03 68.67,21.21 68.67,26.92 67.65,27.94 U1.MOSI | v21.55,39.37 21.23,39.05 IC1.16
  Bottom 0.254: U1.MOSI 66.13,29.21 66.13,32.13 64.73,33.53 64.73,37.47 65.24,37.97 65.24,44.32 63.84,45.72 25.74,45.72 21.55,41.53 v21.55,39.37
SO  (via drill 0.3, 1 pad 1.78)
  Top 0.254: U1.MISO 66.13,29.21 66.13,23.62 65.49,22.99 v65.49,20.57 | v22.63,38.48 22.55,38.4 IC1.17
  Bottom 0.254: U1.MISO 64.22,31.11 64.22,37.97 64.6,38.35 64.6,44.07 63.59,45.09 26.25,45.09 22.63,41.47 v22.63,38.48
VIN  (via drill 0.3)
  Top 0.406: U1.VIN VIN.1 | v12.15,5.59 9.89,5.59 D1.C
  Bottom 0.254: 46.95,5.84 VIN.1
  Bottom 0.406: 46.95,5.84 45.17,7.62 14.19,7.62 v12.15,5.59
VIO
  Top 0.254: IC1.20 19.02,36.45 19.01,36.45 | C4.1 21.26,13.04 21.42,13.21 21.42,13.08 21.55,12.95
  Top 0.406: JP4.2 21.55,12.66 C4.1 | 21.55,12.95 21.55,14.61 20.28,15.88 IC2.5 20.28,27.81 18.8,29.3 C3.1 19.02,35.53 19.02,36.45

### Text on the board
Top: TOP
Bottom: BOT
tPlace: CANdiy-Shield | V2.0 | open | hardware | MISO | MOSI | SCK | 3V3 5V | Logic Level | 5V | GND
Reference: Silkscreen: 21 tPlace + 22 bPlace